# Altium schematic sheet Fornello.SchDoc
size A2
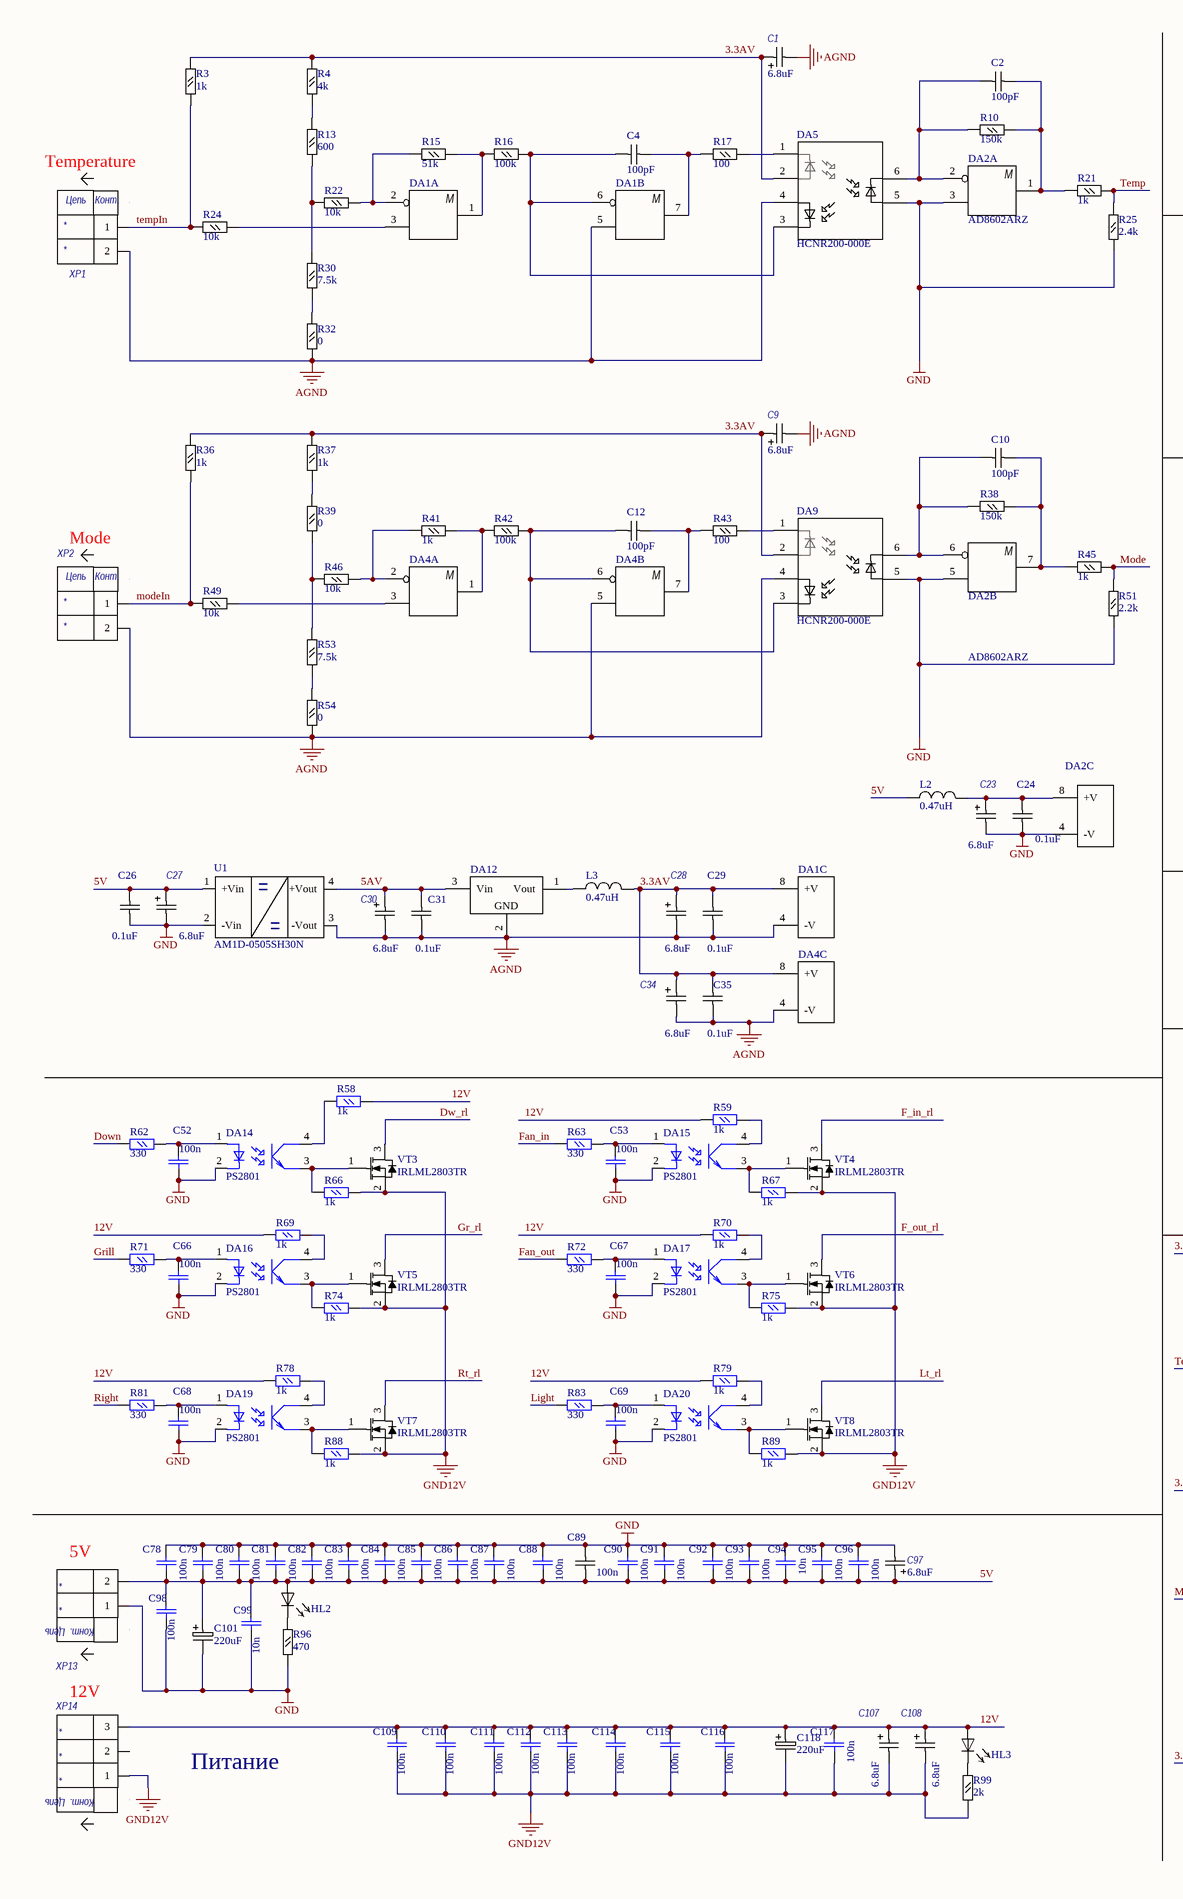
[diagram p0: Fornello.SchDoc, left]
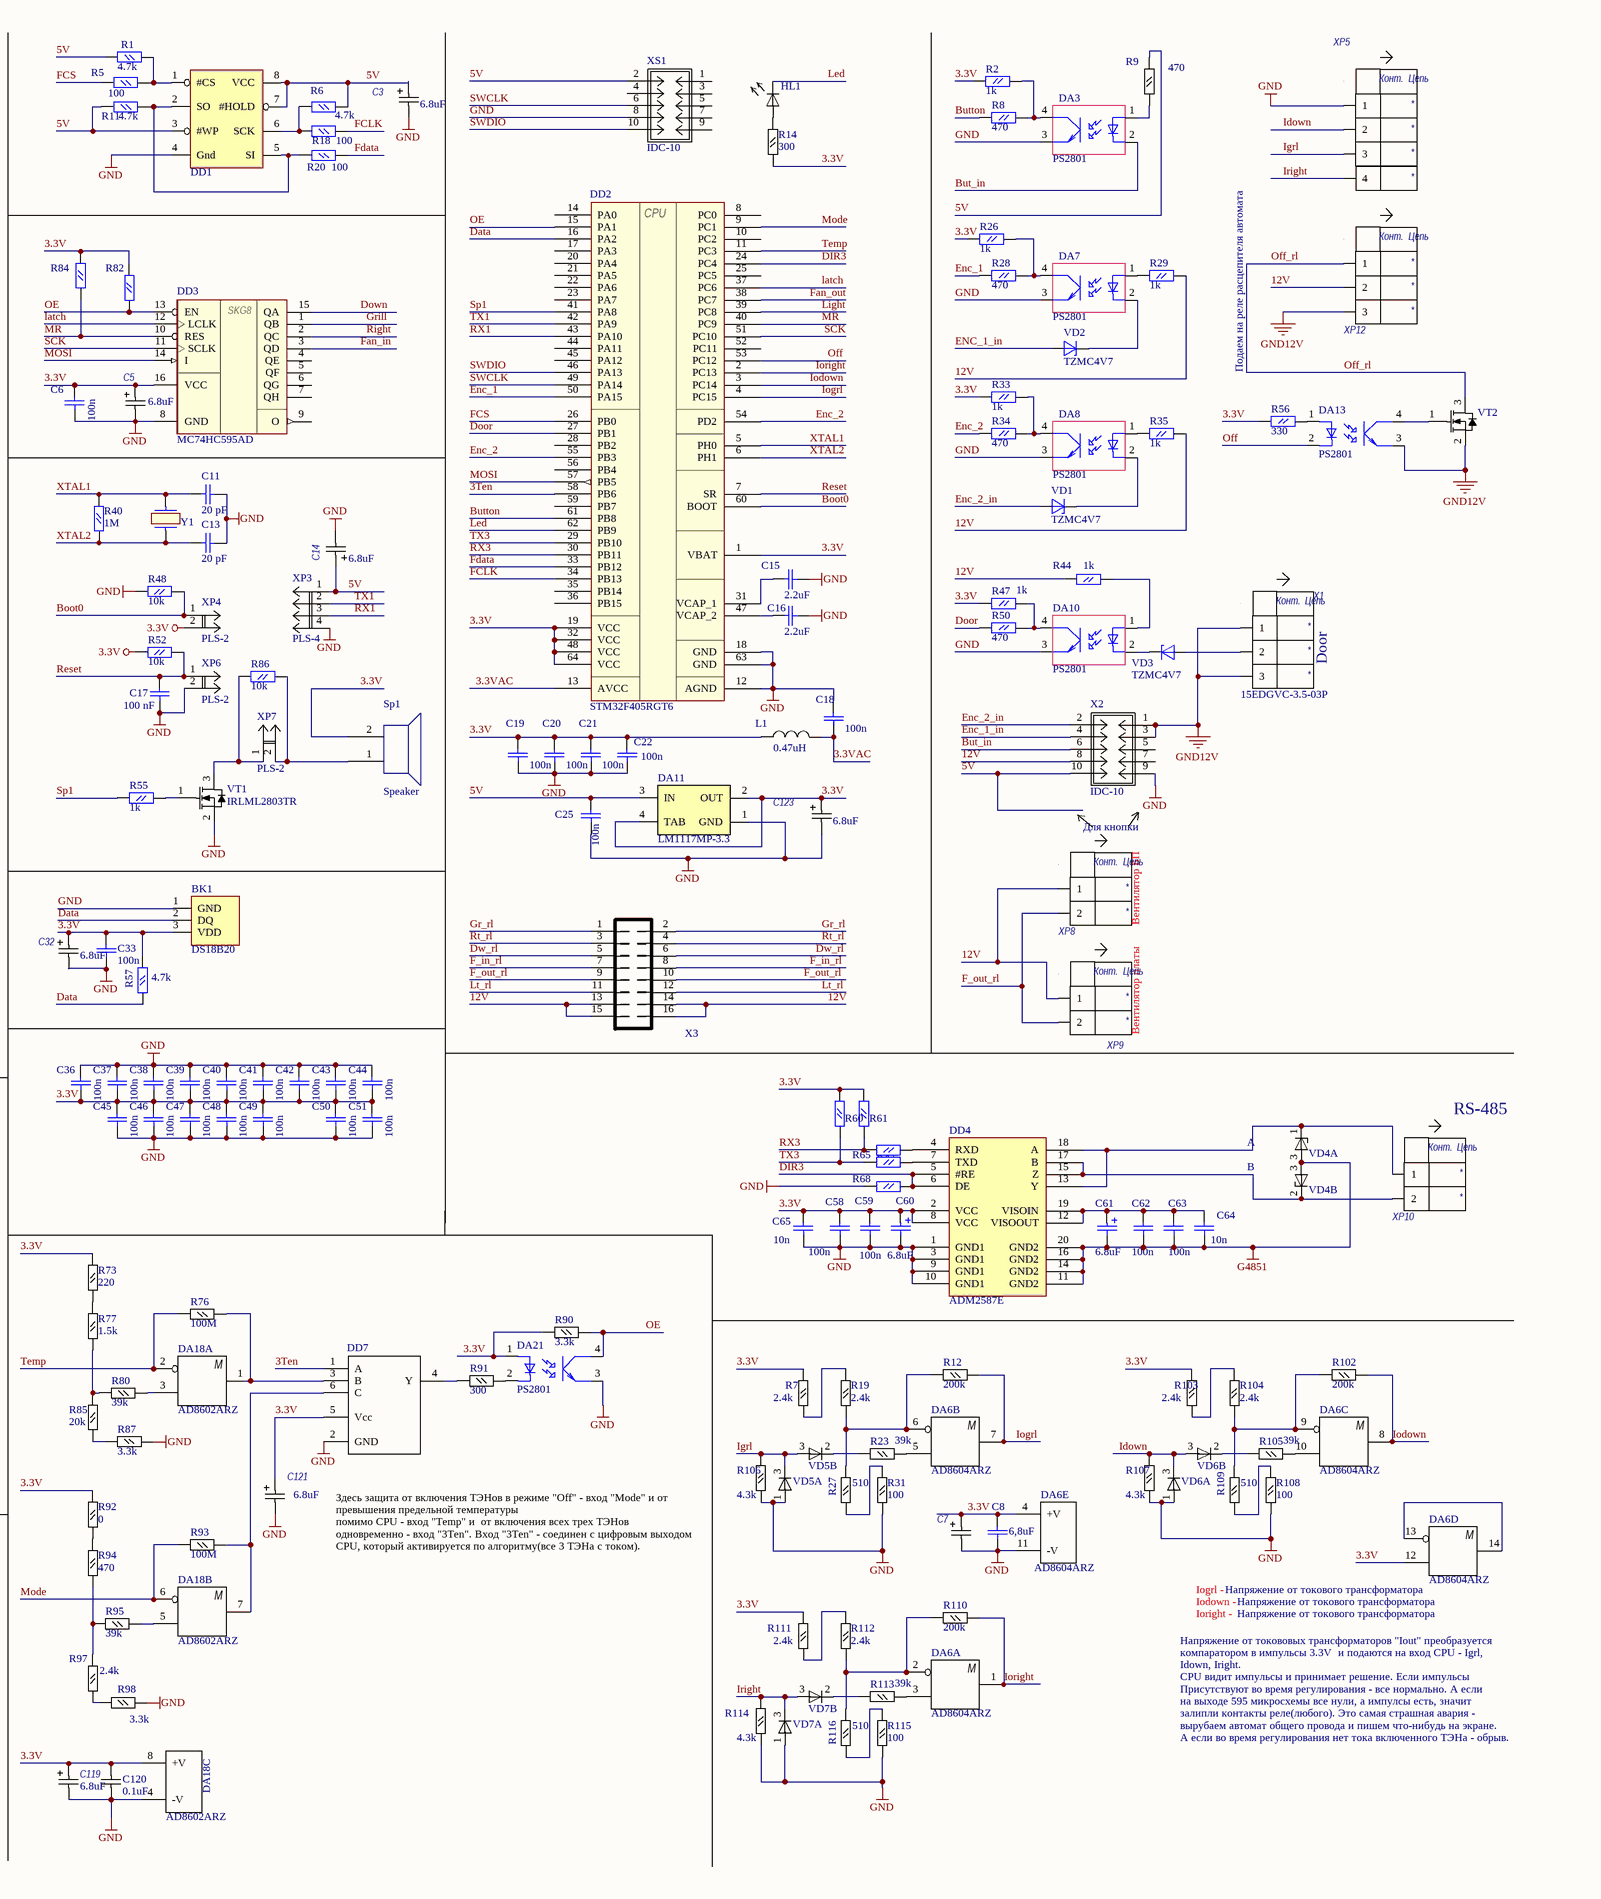
[diagram p1: Fornello.SchDoc, right]

## Parts
BK1  DS18B20  [TO-92]
C1  6.8uF  [TC3216-1206-A]
C2  100pF  [cap0805]
C3  6.8uF  [TC3216-1206-A]
C4  100pF  [cap0805]
C5  6.8uF  [TC3216-1206-A]
C6  100n  [cap0805]
C7  6,8uF  [TC3216-1206-A]
C8  0.1uF  [cap0805]  (value not drawn)
C9  6.8uF  [TC3216-1206-A]
C10  100pF  [cap0805]
C11  20 pF  [cap0805]
C12  100pF  [cap0805]
C13  20 pF  [cap0805]
C14  6.8uF  [TC3216-1206-A]
C15  2.2uF  [cap0805]
C16  2.2uF  [cap0805]
C17  100 nF  [cap0805]
C18  100n  [cap0805]
C19  100n  [cap0805]
C20  100n  [cap0805]
C21  100n  [cap0805]
C22  100n  [cap0805]
C23  6.8uF  [TC3216-1206-A]
C24  0.1uF  [cap0805]
C25  100n  [cap0805]
C26  0.1uF  [cap0805]
C27  6.8uF  [TC3216-1206-A]
C28  6.8uF  [TC3216-1206-A]
C29  0.1uF  [cap0805]
C30  6.8uF  [TC3216-1206-A]
C31  0.1uF  [cap0805]
C32  6.8uF  [TC3216-1206-A]
C33  100n  [cap0805]
C34  6.8uF  [TC3216-1206-A]
C35  0.1uF  [cap0805]
C36  100n  [cap0805]
C37  100n  [cap0805]
C38  100n  [cap0805]
C39  100n  [cap0805]
C40  100n  [cap0805]
C41  100n  [cap0805]
C42  100n  [cap0805]
C43  100n  [cap0805]
C44  100n  [cap0805]
C45  100n  [cap0805]
C46  100n  [cap0805]
C47  100n  [cap0805]
C48  100n  [cap0805]
C49  100n  [cap0805]
C50  100n  [cap0805]
C51  100n  [cap0805]
C52  100n  [cap0805]
C53  100n  [cap0805]
C58  100n  [cap0805]
C59  100n  [cap0805]
C60  6.8uF  [TC3216-1206-A]
C61  6.8uF  [TC3216-1206-A]
C62  100n  [cap0805]
C63  100n  [cap0805]
C64  10n  [cap0805]
C65  10n  [cap0805]
C66  100n  [cap0805]
C67  100n  [cap0805]
C68  100n  [cap0805]
C69  100n  [cap0805]
C78  100n  [cap0805]
C79  100n  [cap0805]
C80  100n  [cap0805]
C81  100n  [cap0805]
C82  100n  [cap0805]
C83  100n  [cap0805]
C84  100n  [cap0805]
C85  100n  [cap0805]
C86  100n  [cap0805]
C87  100n  [cap0805]
C88  100n  [cap0805]
C89  100n  [cap0805]
C90  100n  [cap0805]
C91  100n  [cap0805]
C92  100n  [cap0805]
C93  100n  [cap0805]
C94  10n  [cap0805]
C95  100n  [cap0805]
C96  100n  [cap0805]
C97  6.8uF  [TC3216-1206-A]
C98  100n  [cap0805]
C99  10n  [cap0805]
C101  220uF  [6.3D]
C107  6.8uF  [TC3216-1206-A]
C108  6.8uF  [TC3216-1206-A]
C109  100n  [cap0805]
C110  100n  [cap0805]
C111  100n  [cap0805]
C112  100n  [cap0805]
C113  100n  [cap0805]
C114  100n  [cap0805]
C115  100n  [cap0805]
C116  100n  [cap0805]
C117  100n  [cap0805]
C118  220uF  [6.3D]
C119  6.8uF  [TC3216-1206-A]
C120  0.1uF  [cap0805]
C121  6.8uF  [TC3216-1206-A]
C123  6.8uF  [TC3216-1206-A]
DA1  AD8602ARZ  [SO-8]  (value not drawn)  (parts A,B,C of 3)
DA2  AD8602ARZ  [SO-8]  (parts A,B,C of 3)
DA3  PS2801  [SOP4]
DA4  AD8602ARZ  [SO-8]  (value not drawn)  (parts A,B,C of 3)
DA5  HCNR200-000E  [DIP8]
DA6  AD8604ARZ  [SO-14]  (parts A,B,C,D,E of 5)
DA7  PS2801  [SOP4]
DA8  PS2801  [SOP4]
DA9  HCNR200-000E  [DIP8]
DA10  PS2801  [SOP4]
DA11  LM1117MP-3.3  [SOT223]
DA12  L78L33ACUTR  [SOT89]  (value not drawn)
DA13  PS2801  [SOP4]
DA14  PS2801  [SOP4]
DA15  PS2801  [SOP4]
DA16  PS2801  [SOP4]
DA17  PS2801  [SOP4]
DA18  AD8602ARZ  [SO-8]  (parts A,B,C of 3)
DA19  PS2801  [SOP4]
DA20  PS2801  [SOP4]
DA21  PS2801  [SOP4]
DD1  (no value)  [SO-8_N]
DD2  STM32F405RGT6  [LQFP64]
DD3  MC74HC595AD  [SO-16]
DD4  ADM2587E  [SO-20_N]
DD7  SN74LVC1G97  [SOT23-6]  (value not drawn)
HL1  KP-2012SGC  [Led0805]  (value not drawn)
HL2  KP-2012SRC  [Led0805]  (value not drawn)
HL3  KP-2012SRC  [Led0805]  (value not drawn)
L1  0.47uH  [res0805]
L2  0.47uH  [0805]
L3  0.47uH  [0805]
R1  4.7k  [res0805]
R2  1k  [res0805]
R3  1k  [res0805]
R4  4k  [res0805]
R5  100  [res0805]
R6  4.7k  [res0805]
R7  2.4k  [res0805]
R8  470  [res0805]
R9  470  [res0805]
R10  150k  [res0805]
R11  4.7k  [res0805]
R12  200k  [res0805]
R13  600  [res0805]
R14  300  [res0805]
R15  51k  [res0805]
R16  100k  [res0805]
R17  100  [res0805]
R18  100  [res0805]
R19  2.4k  [res0805]
R20  100  [res0805]
R21  1k  [res0805]
R22  10k  [res0805]
R23  39k  [res0805]
R24  10k  [res0805]
R25  2.4k  [res0805]
R26  1k  [res0805]
R27  510  [res0805]
R28  470  [res0805]
R29  1k  [res0805]
R30  7.5k  [res0805]
R31  100  [res0805]
R32  0  [res0805]
R33  1k  [res0805]
R34  470  [res0805]
R35  1k  [res0805]
R36  1k  [res0805]
R37  1k  [res0805]
R38  150k  [res0805]
R39  0  [res0805]
R40  1M  [res0805]
R41  1k  [res0805]
R42  100k  [res0805]
R43  100  [res0805]
R44  1k  [res0805]
R45  1k  [res0805]
R46  10k  [res0805]
R47  1k  [res0805]
R48  10k  [res0805]
R49  10k  [res0805]
R50  470  [res0805]
R51  2.2k  [res0805]
R52  10k  [res0805]
R53  7.5k  [res0805]
R54  0  [res0805]
R55  1k  [res0805]
R56  330  [res0805]
R57  4.7k  [res0805]
R58  1k  [res0805]
R59  1k  [res0805]
R60  4.7k  [res0805]  (value not drawn)
R61  4.7k  [res0805]  (value not drawn)
R62  330  [res0805]
R63  330  [res0805]
R64  100  [res0805]  (value not drawn)
R65  100  [res0805]  (value not drawn)
R66  1k  [res0805]
R67  1k  [res0805]
R68  4.7k  [res0805]  (value not drawn)
R69  1k  [res0805]
R70  1k  [res0805]
R71  330  [res0805]
R72  330  [res0805]
R73  220  [res0805]
R74  1k  [res0805]
R75  1k  [res0805]
R76  100M  [res0805]
R77  1.5k  [res0805]
R78  1k  [res0805]
R79  1k  [res0805]
R80  39k  [res0805]
R81  330  [res0805]
R82  4.7k  [res0805]  (value not drawn)
R83  330  [res0805]
R84  4.7k  [res0805]  (value not drawn)
R85  20k  [res0805]
R86  10k  [res0805]
R87  3.3k  [res0805]
R88  1k  [res0805]
R89  1k  [res0805]
R90  3.3k  [res0805]
R91  300  [res0805]
R92  0  [res0805]
R93  100M  [res0805]
R94  470  [res0805]
R95  39k  [res0805]
R96  470  [res0805]
R97  2.4k  [res0805]
R98  3.3k  [res0805]
R99  2k  [res0805]
R102  200k  [res0805]
R103  2.4k  [res0805]
R104  2.4k  [res0805]
R105  39k  [res0805]
R106  4.3k  [res0805]
R107  4.3k  [res0805]
R108  100  [res0805]
R109  510  [res0805]
R110  200k  [res0805]
R111  2.4k  [res0805]
R112  2.4k  [res0805]
R113  39k  [res0805]
R114  4.3k  [res0805]
R115  100  [res0805]
R116  510  [res0805]
Sp1  Speaker  [Speaker]
U1  AM1D-0505SH30N  [SIP7S]
VD1  TZMC4V7  [SOD80]
VD2  TZMC4V7  [SOD80]
VD3  TZMC4V7  [SOD80]
VD4  SM712-02HTG  [SOT23]  (value not drawn)  (parts A,B of 2)
VD5  BAV99  [SOT23]  (value not drawn)  (parts A,B of 2)
VD6  BAV99  [SOT23]  (value not drawn)  (parts A,B of 2)
VD7  BAV99  [SOT23]  (value not drawn)  (parts A,B of 2)
VT1  IRLML2803TR  [SOT23]
VT2  IRLML2803TR  [SOT23]  (value not drawn)
VT3  IRLML2803TR  [SOT23]
VT4  IRLML2803TR  [SOT23]
VT5  IRLML2803TR  [SOT23]
VT6  IRLML2803TR  [SOT23]
VT7  IRLML2803TR  [SOT23]
VT8  IRLML2803TR  [SOT23]
X1  15EDGVC-3.5-03P  [15EDGVC-3.5-03P-2]
X2  IDC-10  [IDC-10]
X3  PBD-16  [Pl_connect]  (value not drawn)
XP1  15EDGVC-3.5-02P  [15EDGVC-3.5-02P]  (value not drawn)
XP2  15EDGVC-3.5-02P  [15EDGVC-3.5-02P]  (value not drawn)
XP3  PLS-4  [PLS4]
XP4  PLS-2  [PLS2]
XP5  15EDGVC-3.5-04P  [15EDGVC-3.5-04P]  (value not drawn)
XP6  PLS-2  [PLS2]
XP7  PLS-2  [PLS2]
XP8  15EDGVC-3.5-02P  [15EDGVC-3.5-02P]  (value not drawn)
XP9  15EDGVC-3.5-02P  [15EDGVC-3.5-02P]  (value not drawn)
XP10  15EDGVC-3.5-02P  [15EDGVC-3.5-02P]  (value not drawn)
XP12  15EDGVC-3.5-03P  [15EDGVC-3.5-03P-2]  (value not drawn)
XP13  15EDGVC-3.5-02P  [15EDGVC-3.5-02P]  (value not drawn)
XP14  15EDGVC-3.5-03P  [15EDGVC-3.5-03P-2]  (value not drawn)
XS1  IDC-10  [IDC-10]
Y1  8MHz  [XT49M]  (value not drawn)

## Nets
3.3V: BK1.3(VDD) C5.1 C6.1 C7.1 C8.1 C19.1 C20.1 C21.1 C22.1 C32.1 C33.1 C36.2 C37.2 C38.2 C39.2 C40.2 C41.2 C42.2 C43.2 C44.2 C45.1 C46.1 C47.1 C48.1 C49.1 C50.1 C51.1 C58.1 C59.1 C60.1 C65.1 C119.1 C120.1 C121.1 C123.1 DA6.4(+V) DA6.12(IN+) DA11.2(OUT) DA11.4(TAB) DA18.8(+V) DA21.1(A) DD2.1(VBAT) DD2.19(VCC) DD2.32(VCC) DD2.48(VCC) DD2.64(VCC) DD3.16(VCC) DD4.2(VCC) DD4.8(VCC) DD7.5(Vcc) L1.1 R2.2 R7.2 R14.1 R26.2 R33.2 R47.2 R52.1 R56.2 R57.2 R60.2 R61.2 R73.2 R82.2 R84.2 R90.2 R92.2 R103.2 R111.2 Sp1.2 XP4.2
AGND: C1.2 C9.2 C28.2 C29.1 C30.2 C31.1 C34.2 C35.1 DA1.4(-V) DA1.5(IN+) DA4.4(-V) DA4.5(IN+) DA5.4(PD1_A) DA9.4(PD1_A) DA12.0(GND) DA12.2(GND) R32.1 R54.1 U1.3(-Vout) XP1.2 XP2.2
G4851: C61.2 C62.2 C63.2 C64.2 DD4.11(GND2) DD4.14(GND2) DD4.16(GND2) DD4.20(GND2) VD4.3(A)
GND: BK1.1(GND) C3.2 C5.2 C6.2 C7.2 C8.2 C11.2 C13.2 C14.2 C15.2 C16.2 C17.2 C18.1 C19.2 C20.2 C21.2 C22.2 C23.2 C24.1 C25.2 C26.1 C27.2 C32.2 C33.2 C36.1 C37.1 C38.1 C39.1 C40.1 C41.1 C42.1 C43.1 C44.1 C45.2 C46.2 C47.2 C48.2 C49.2 C50.2 C51.2 C52.2 C53.2 C58.2 C59.2 C60.2 C65.2 C66.2 C67.2 C68.2 C69.2 C78.1 C79.1 C80.1 C81.1 C82.1 C83.1 C84.1 C85.1 C86.1 C87.1 C88.1 C89.1 C90.1 C91.1 C92.1 C93.1 C94.1 C95.1 C96.1 C97.2 C98.2 C99.2 C101.2 C119.2 C120.2 C121.2 C123.2 DA2.3(IN+) DA2.4(-V) DA2.5(IN+) DA3.3(E) DA5.5(PD2_A) DA6.11(-V) DA7.3(E) DA8.3(E) DA9.5(PD2_A) DA10.3(E) DA11.1(GND) DA14.2(K) DA15.2(K) DA16.2(K) DA17.2(K) DA18.4(-V) DA19.2(K) DA20.2(K) DA21.3(E) DD1.4(Gnd) DD2.12(AGND) DD2.18(GND) DD2.63(GND) DD3.8(GND) DD4.1(GND1) DD4.3(GND1) DD4.9(GND1) DD4.10(GND1) DD7.2(GND) R25.1 R31.1 R48.1 R51.1 R68.2 R87.1 R96.2 R98.1 R106.1 R107.1 R108.1 R114.1 R115.1 U1.2(-Vin) VD5.1(A1) VD6.1(A1) VD7.1(A1) VT1.2(D) X2.9 XP3.4 XP5.1 XP6.2 XP13.1 XS1.8
GND12V: C107.2 C108.2 C109.2 C110.2 C111.2 C112.2 C113.2 C114.2 C115.2 C116.2 C117.2 C118.2 DA13.3(E) R66.1 R67.1 R74.1 R75.1 R88.1 R89.1 R99.2 VT2.2(D) VT3.2(D) VT4.2(D) VT5.2(D) VT6.2(D) VT7.2(D) VT8.2(D) X1.1 X1.3 X2.1 X2.3 XP12.3 XP14.1
3.3AV: C1.1 C9.1 C28.1 C29.2 C34.1 C35.2 DA1.8(+V) DA4.8(+V) DA5.2(LED_A) DA9.2(LED_A) L3.2 R3.2 R4.2 R36.2 R37.2
3.3VAC: C18.2 DD2.13(AVCC) L1.2
3Ten: DD2.58(PB6) DD7.1(A)
5AV: C30.1 C31.2 DA12.3(Vin) U1.4(+Vout)
5V: C3.1 C14.1 C25.1 C26.2 C27.1 C78.2 C79.2 C80.2 C81.2 C82.2 C83.2 C84.2 C85.2 C86.2 C87.2 C88.2 C89.2 C90.2 C91.2 C92.2 C93.2 C94.2 C95.2 C96.2 C97.1 C98.1 C99.1 C101.1 DA11.3(IN) DD1.3(#WP) DD1.7(#HOLD) DD1.8(VCC) HL2.1(A) L2.1 R1.1 R6.2 R9.2 R11.1 U1.1(+Vin) X2.10 XP3.1 XP13.2 XS1.2
12V: C107.1 C108.1 C109.1 C110.1 C111.1 C112.1 C113.1 C114.1 C115.1 C116.1 C117.1 C118.1 HL3.1(A) R29.2 R35.2 R44.1 R58.2 R59.2 R69.2 R70.2 R78.2 R79.2 X2.8 X3.13 X3.14 X3.15 X3.16 XP8.1 XP9.1 XP12.2 XP14.3
Boot0: DD2.60(BOOT) R48.2 XP4.1
But_in: DA3.2(K) X2.6
Button: DD2.61(PB8) R8.2
Data: BK1.2(DQ) DD2.16(PA2) R57.1
DIR3: DD2.24(PC4) DD4.5(#RE) DD4.6(DE) R68.1
Door: DD2.27(PB1) R50.2
Down: DD3.15(QA) R62.1
Dw_rl: VT3.3(S) X3.5 X3.6
Enc_1: DD2.50(PA15) R28.2
ENC_1_in: VD2.1(A) X2.4
Enc_2: DD2.54(PD2) DD2.55(PB3) R34.2
Enc_2_in: VD1.1(A) X2.2
F_in_rl: VT4.3(S) X3.7 X3.8
F_out_rl: VT6.3(S) X3.9 X3.10 XP8.2 XP9.2
Fan_in: DD3.3(QD) R63.1
Fan_out: DD2.38(PC7) R72.1
FCLK: DD2.34(PB13) R18.2
FCS: DD2.26(PB0) R5.1
Fdata: DD2.33(PB12) R20.2
Gr_rl: VT5.3(S) X3.1 X3.2
Grill: DD3.1(QB) R71.1
Idown: R107.2 VD6.3(COM) XP5.2
Igrl: R106.2 VD5.3(COM) XP5.3
Iodown: DA6.8(OUT) DD2.3(PC14) R102.2
Iogrl: DA6.7(OUT) DD2.4(PC15) R12.2
Ioright: DA6.1(OUT) DD2.2(PC13) R110.2
Iright: R114.2 VD7.3(COM) XP5.4
latch: DD2.37(PC6) DD3.12(LCLK)
Led: DD2.62(PB9) HL1.2(K)
Light: DD2.39(PC8) R83.1
Lt_rl: VT8.3(S) X3.11 X3.12
Mode: DA18.6(IN-) DD2.9(PC1) R45.2 R51.2 R93.1
modeIn: R36.1 R49.1 XP2.1
MOSI: DD2.57(PB5) DD3.14(I)
MR: DD2.40(PC9) DD3.10(RES) R84.1
OE: DA21.4(C) DD2.15(PA1) DD3.13(EN) R82.1 R90.1
Off: DA13.2(K) DD2.53(PC12)
Off_rl: VT2.3(S) XP12.1
Reset: C17.1 DD2.7(SR) R52.2 XP6.1
Right: DD3.2(QC) R81.1
Rt_rl: VT7.3(S) X3.3 X3.4
RX1: DD2.43(PA10) XP3.3
RX3: DD2.30(PB11) R61.1 R64.2
SCK: DD2.51(PC10) DD3.11(SCLK)
Sp1: DD2.41(PA8) R55.1
SWCLK: DD2.49(PA14) XS1.6
SWDIO: DD2.46(PA13) XS1.10
Temp: DA18.2(IN-) DD2.11(PC3) R21.2 R25.2 R76.1
tempIn: R3.1 R24.1 XP1.1
TX1: DD2.42(PA9) XP3.2
TX3: DD2.29(PB10) R60.1 R65.2
XTAL1: C11.1 DD2.5(PH0) R40.2 Y1.2(L2)
XTAL2: C13.1 DD2.6(PH1) R40.1 Y1.1(L1)
NetC2_1: C2.1 DA2.2(IN-) DA5.6(PD2_C) R10.1
NetC2_2: C2.2 DA2.1(OUT) R10.2 R21.1
NetC4_1: C4.1 DA1.6(IN-) DA5.3(PD1_C) R16.2
NetC4_2: C4.2 DA1.7(OUT) R17.1
NetC10_1: C10.1 DA2.6(IN-) DA9.6(PD2_C) R38.1
NetC10_2: C10.2 DA2.7(OUT) R38.2 R45.1
NetC12_1: C12.1 DA4.6(IN-) DA9.3(PD1_C) R42.2
NetC12_2: C12.2 DA4.7(OUT) R43.1
NetC15_1: C15.1 DD2.31(VCAP_1)
NetC16_1: C16.1 DD2.47(VCAP_2)
NetC23_1: C23.1 C24.2 DA2.8(+V) L2.2
NetC52_1: C52.1 DA14.1(A) R62.2
NetC53_1: C53.1 DA15.1(A) R63.2
NetC61_1: C61.1 C62.1 C63.1 C64.1 DD4.12(VISOOUT) DD4.19(VISOIN)
NetC66_1: C66.1 DA16.1(A) R71.2
NetC67_1: C67.1 DA17.1(A) R72.2
NetC68_1: C68.1 DA19.1(A) R81.2
NetC69_1: C69.1 DA20.1(A) R83.2
NetDA1_1: DA1.1(OUT) R15.2 R16.1
NetDA1_2: DA1.2(IN-) R15.1 R22.2
NetDA1_3: DA1.3(IN+) R24.2
NetDA3_1: DA3.1(A) R9.1
NetDA3_4: DA3.4(C) R2.1 R8.1
NetDA4_1: DA4.1(OUT) R41.2 R42.1
NetDA4_2: DA4.2(IN-) R41.1 R46.2
NetDA4_3: DA4.3(IN+) R49.2
NetDA5_1: DA5.1(LED_C) R17.2
NetDA6_2: DA6.2(IN-) R110.1 R112.1 R116.2
NetDA6_3: DA6.3(IN+) R113.2
NetDA6_5: DA6.5(IN+) R23.2
NetDA6_6: DA6.6(IN-) R12.1 R19.1 R27.2
NetDA6_9: DA6.9(IN-) R102.1 R104.1 R109.2
NetDA6_10: DA6.10(IN+) R105.2
NetDA6_13: DA6.13(IN-) DA6.14(OUT)
NetDA7_1: DA7.1(A) R29.1
NetDA7_2: DA7.2(K) VD2.2(K)
NetDA7_4: DA7.4(C) R26.1 R28.1
NetDA8_1: DA8.1(A) R35.1
NetDA8_2: DA8.2(K) VD1.2(K)
NetDA8_4: DA8.4(C) R33.1 R34.1
NetDA9_1: DA9.1(LED_C) R43.2
NetDA10_1: DA10.1(A) R44.2
NetDA10_2: DA10.2(K) VD3.2(K)
NetDA10_4: DA10.4(C) R47.1 R50.1
NetDA12_1: DA12.1(Vout) L3.1
NetDA13_1: DA13.1(A) R56.1
NetDA13_4: DA13.4(C) VT2.1(G)
NetDA14_3: DA14.3(E) R66.2 VT3.1(G)
NetDA14_4: DA14.4(C) R58.1
NetDA15_3: DA15.3(E) R67.2 VT4.1(G)
NetDA15_4: DA15.4(C) R59.1
NetDA16_3: DA16.3(E) R74.2 VT5.1(G)
NetDA16_4: DA16.4(C) R69.1
NetDA17_3: DA17.3(E) R75.2 VT6.1(G)
NetDA17_4: DA17.4(C) R70.1
NetDA18_1: DA18.1(OUT) DD7.3(B) R76.2
NetDA18_3: DA18.3(IN+) R80.2
NetDA18_5: DA18.5(IN+) R95.2
NetDA18_7: DA18.7(OUT) DD7.6(C) R93.2
NetDA19_3: DA19.3(E) R88.2 VT7.1(G)
NetDA19_4: DA19.4(C) R78.1
NetDA20_3: DA20.3(E) R89.2 VT8.1(G)
NetDA20_4: DA20.4(C) R79.1
NetDA21_2: DA21.2(K) R91.1
NetDD1_1: DD1.1(#CS) R1.2 R5.2
NetDD1_2: DD1.2(SO) DD1.5(SI) R11.2 R20.1
NetDD1_6: DD1.6(SCK) R6.1 R18.1
NetDD4_4: DD4.4(RXD) R64.1
NetDD4_7: DD4.7(TXD) R65.1
NetDD4_13: DD4.13(Y) DD4.18(A) VD4.1(K1) XP10.1
NetDD4_15: DD4.15(Z) DD4.17(B) VD4.2(K2) XP10.2
NetDD7_4: DD7.4(Y) R91.2
NetHL1_1: HL1.1(A) R14.2
NetHL2_2: HL2.2(K) R96.1
NetHL3_2: HL3.2(K) R99.1
NetR4_1: R4.1 R13.2
NetR7_1: R7.1 R19.2
NetR13_1: R13.1 R22.1 R30.2
NetR23_1: R23.1 VD5.2(K2)
NetR27_1: R27.1 R31.2
NetR30_1: R30.1 R32.2
NetR37_1: R37.1 R39.2
NetR39_1: R39.1 R46.1 R53.2
NetR53_1: R53.1 R54.2
NetR55_2: R55.2 VT1.1(G)
NetR73_1: R73.1 R77.2
NetR77_1: R77.1 R80.1 R85.2
NetR85_1: R85.1 R87.2
NetR86_1: R86.1 VT1.3(S) XP7.1
NetR86_2: R86.2 Sp1.1 XP7.2
NetR92_1: R92.1 R94.2
NetR94_1: R94.1 R95.1 R97.2
NetR97_1: R97.1 R98.2
NetR103_1: R103.1 R104.2
NetR105_1: R105.1 VD6.2(K2)
NetR108_2: R108.2 R109.1
NetR111_1: R111.1 R112.2
NetR113_1: R113.1 VD7.2(K2)
NetR115_2: R115.2 R116.1
NetVD3_1: VD3.1(A) X1.2

Not connected (* = marked no-connect by the designer): DD2 8(PC0) 10(PC2) 14(PA0) 17(PA3) 20(PA4) 21(PA5) 22(PA6) 23(PA7) 25(PC5) 28(PB2) 35(PB14) 36(PB15) 44(PA11) 45(PA12) 52(PC11) 56(PB4) 59(PB7); DD3 4(QE) 5(QF) 6(QG) 7(QH) 9(O); X2 5 7; XP14 2; XS1 1 3 4 5 7 9

## Notes on the sheet
- Temperature
- Подаем на реле расцепителя автомата
- Mode
- Door
- Для кнопки
- Вентилятор БП
- Вентилятор платы
- RS-485
- A
- B
- (near XP13) 5V
- Здесь защита от включения ТЭНов в режиме "Off" - вход "Mode" и от превышения предельной температуры
  помимо CPU - вход "Temp" и  от включения всех трех ТЭНов одновременно - вход "3Ten". Вход "3Ten" - соединен с цифровым выходом CPU, который активируется по алгоритму(все 3 ТЭНа с током).
- Iogrl -
- Iodown -
- Ioright -
- (near DA6) Напряжение от токового трансформатора
- Напряжение от токововых трансформаторов "Iout" преобразуется
- компаратором в импульсы 3.3V
- CPU видит импульсы и принимает решение. Если импульсы
- Idown, Iright.
- и подаются на вход CPU - Igrl,
- (near XP14) 12V
- Присутствуют во время регулирования - все нормально. А если
- на выходе 595 микросхемы все нули, а импулсы есть, значит
- залипли контакты реле(любого). Это самая страшная авария -
- вырубаем автомат общего провода и пишем что-нибудь на экране.
- А если во время регулирования нет тока включенного ТЭНа - обрыв.
- Питание
- (in symbol 15EDGVC-3.5-02P) Конт.; Цепь
- (in symbol 15EDGVC-3.5-03P) Цепь; Конт.
- (in symbol 15EDGVC-3.5-04P) Конт.; Цепь
- (in symbol AD8602ARZ, part A) M
- (in symbol AD8602ARZ, part B) M
- (in symbol AD8604ARZ, part A) M
- (in symbol AD8604ARZ, part B) M
- (in symbol AD8604ARZ, part C) M
- (in symbol AD8604ARZ, part D) M
- (in symbol MC74HC595AD) SKG8
- (in symbol STM32F405RGT6) CPU

## Library data of the parts
BK1 = DS18B20: Датчик Далласа; Group: Микросхемы; SType: TH; NPads: 3; Part Number: DS18B20; ValueSCH: DS18B20; Package: TO-92; HelpURL: \DATA\DS18B20.pdf
C1 C3 C5 C7 C9 C14 C23 C27 C28 C30 C32 C34 C60 C61 C97 C107 C108 C119 C121 C123 = capA: Танталовый конденсатор, SMD; Part Number: capA; Group: Конденсаторы; NPads: 2; SType: SMD; Package: SMD A
  C1 C3 C5 C9 C14 C23 C27 C28 C30 C32 C34 C60 C61 C97 C107 C108 C119 C121 C123: ValueSCH: 6.8uF
  C7: ValueSCH: 6,8uF
C2 C4 C6 C8 C10-C13 C15-C22 C24-C26 C29 C31 C33 C35-C53 C58 C59 C62-C69 C78-C96 C98 C99 C109-C117 C120 = cap0805: Керамический конденсатор, SMD; Group: Конденсаторы; NPads: 2; Part Number: cap0805; SType: SMD; Package: SMD 0805
  C2 C4 C10 C12: ValueSCH: 100pF
  C6 C18-C22 C25 C33 C36-C53 C58 C59 C62 C63 C66-C69 C78-C93 C95 C96 C98 C109-C117: ValueSCH: 100n
  C8 C24 C26 C29 C31 C35 C120: ValueSCH: 0.1uF
  C11 C13: ValueSCH: 20 pF
  C15 C16: ValueSCH: 2.2uF
  C17: ValueSCH: 100 nF
  C64 C65 C94 C99: ValueSCH: 10n
C101 C118 = UCD1V101MCL6GS: Алюминиевый конденсатор 6.3mm; Group: Конденсаторы; SType: SMD; NPads: 2; Part Number: UCD1V101MCL6GS; ValueSCH: 220uF; Package: Can - SMD
DA1 DA2 DA4 DA18 = AD8602ARZ: Операционный усилитель 2 в 1; Group: Микросхемы; SType: SMD; NPads: 8; Part Number: AD8602ARZ; ValueSCH: AD8602ARZ; Package: SO-8
DA3 DA7 DA8 DA10 DA13-DA17 DA19-DA21 = PS2801: Оптопара; Group: Микросхемы; SType: SMD; NPads: 4; Part Number: PS2801; ValueSCH: PS2801; Package: SOP4; HelpURL: \DATA\PS2801.pdf
DA5 DA9 = HCNR200-000E: Аналоговый оптрон прецизионный; Group: Микросхемы; SType: TH; NPads: 8; Part Number: HCNR200-000E; ValueSCH: HCNR200-000E; Package: SOP-8
DA6 = AD8604ARZ: Операционный усилитель 4 в 1; Group: Микросхемы; SType: SMD; NPads: 14; Part Number: AD8604ARZ; ValueSCH: AD8604ARZ; Package: SO-14
DA11 = LM1117MP-3.3: Линейный стабилизатор 3.3V; Group: Микросхемы; SType: SMD; Analog: SPX1117M3L-3.3; NPads: 4; Part Number: LM1117MP-3.3; ValueSCH: LM1117MP-3.3; Package: SOT223; HelpURL: \DATA\LM1117.pdf
DA12 = L78L33ACUTR: Линейный стабилизатор 3.3V; Group: Микросхемы; SType: SMD; NPads: 4; Part Number: L78L33ACUTR; ValueSCH: L78L33ACUTR; Package: SOT89
DD1 = FM25040S
DD2 = STM32F405RGT6: Микроконтроллер 32 бит CORTEX M4; Group: Микросхемы; SType: SMD; NPads: 64; Part Number: STM32F405RGT6; ValueSCH: STM32F405RGT6; Package: LQFP64
DD3 = MC74HC595AD: 3-х разрядный сдвиговый регистр; Group: Микросхемы; SType: SMD; NPads: 16; Part Number: MC74HC595AD; ValueSCH: MC74HC595AD; Package: SO-16
DD4 = ADM2587E: Трансивер RS-485 / RS-422; Group: Микросхемы; SType: SMD; NPads: 20; Part Number: ADM2587E; ValueSCH: ADM2587E; Package: SO-20; HelpURL: \DATA\ADM2587E.pdf
DD7 = SN74LVC1G11DBVR: Блок одиночный 3И; Group: Микросхемы; SType: SMD; NPads: 6; Part Number: SN74LVC1G11DBVR; ValueSCH: SN74LVC1G97; Package: SOT23-6
HL1 = KP-2012SGC: SMD светодиод зеленый; Group: Диоды; NPads: 2; Part Number: KP-2012SGC; ValueSCH: KP-2012SGC; SType: SMD; Package: SMD 0805
HL2 HL3 = KP-2012SRC: SMD светодиод красный; Group: Диоды; NPads: 2; Part Number: KP-2012SRC; ValueSCH: KP-2012SRC; SType: SMD; Package: SMD 0805
L1 = L0805: Чип-индуктивность, SMD; Part Number: L0805; Group: Индукивности; NPads: 2; SType: SMD; ValueSCH: 0.47uH; Package: SMD 0805
L2 L3 = L0805: Чип-индуктивность, SMD; Part Number: L0805; Group: Индуктивности; NPads: 2; ValueSCH: 0.47uH; SType: SMD; Package: SMD 0805
R1-R99 R102-R116 = res0805: Резистор 0.125 W, SMD; Group: Резисторы; NPads: 2; Part Number: res0805; SType: SMD; Package: SMD 0805
  R1 R6 R11 R57 R60 R61 R68 R82 R84: ValueSCH: 4.7k
  R2 R3 R21 R26 R29 R33 R35-R37 R41 R44 R45 R47 R58 R59 R66 R67 R69 R70 R74 R75 R78 R79 R88 R89: ValueSCH: 1k
  R4: ValueSCH: 4k
  R5 R17 R18 R20 R31 R43 R64 R65 R108 R115: ValueSCH: 100
  R7 R19 R25 R97 R103 R104 R111 R112: ValueSCH: 2.4k
  R8 R9 R28 R34 R50 R94 R96: ValueSCH: 470
  R10 R38: ValueSCH: 150k
  R12 R102 R110: ValueSCH: 200k
  R13: ValueSCH: 600
  R14 R91: ValueSCH: 300
  R15: ValueSCH: 51k
  R16 R42: ValueSCH: 100k
  R22 R24 R46 R49: ValueSCH: 10k
  R23 R80 R95 R105 R113: ValueSCH: 39k
  R27 R109 R116: ValueSCH: 510
  R30 R53: ValueSCH: 7.5k
  R32 R39 R54 R92: ValueSCH: 0
  R40: ValueSCH: 1M
  R48 R52 R86: ValueSCH: 10k; HelpURL: C:\intmash\DBLIB2\DATASHEETS\Resistors\passive09-resistors-smd.pdf
  R51: ValueSCH: 2.2k
  R55: ValueSCH: 1k; HelpURL: C:\intmash\DBLIB2\DATASHEETS\Resistors\passive09-resistors-smd.pdf
  R56 R62 R63 R71 R72 R81 R83: ValueSCH: 330
  R73: ValueSCH: 220
  R76 R93: ValueSCH: 100M
  R77: ValueSCH: 1.5k
  R85: ValueSCH: 20k
  R87 R90 R98: ValueSCH: 3.3k
  R99: ValueSCH: 2k
  R106 R107 R114: ValueSCH: 4.3k
U1 = AM1D-0505SH30N: Преобразователь 1Вт 5В ->5В; Group: Микросхемы; SType: TH; NPads: 4; Part Number: AM1D-0505SH30N; ValueSCH: AM1D-0505SH30N; Package: SIP7
VD1-VD3 = TZMC13: Стабилитрон 13V; Part Number: TZMC13; Group: Диоды; SType: SMD; Analog: ZMM13, BZV55C13; NPads: 2; ValueSCH: TZMC4V7; Package: SOD80; HelpURL: \DATA\tzmc13.pdf
VD4 = SM712-02HTG: TVS диодная сборка 2 в 1; Group: Диоды; SType: SMD; Analog: F6450CT-ND; NPads: 3; Part Number: SM712-02HTG; ValueSCH: SM712-02HTG; Package: SOT23-3
VD5-VD7 = BAV99: Диодная сборка 2 в 1; Group: Диоды; SType: SMD; NPads: 3; Part Number: BAV99; ValueSCH: BAV99; Package: SOT23-3
VT1-VT8 = IRLML2803TR: N-канальный MOSFET 30В 1.2А; Part Number: IRLML2803TR; ValueSCH: IRLML2803TR
X1 XP12 XP14 = 15EDGVC-3.5-03P: Вилка на плату 3 конт. шаг 3.5мм; Group: Разъемы; SType: TH; NPads: 3; VariantName1: *; VariantName2: *; VariantName3: *; ValueSCH: 15EDGVC-3.5-03P; Part Number: 15EDGVC-3.5-03P
X2 XS1 = IDC-10: Вилка на плату 5х2 контактов шаг 2.54мм; Group: Разъемы; SType: TH; NPads: 10; ValueSCH: IDC-10; Part Number: IDC-10
X3 = PBD-16: Розетка на плату 8х2 контактов.2,54 х 2,54 мм; Group: Разъемы; SType: TH; NPads: 16; Part Number: PBD-16; ValueSCH: PBD-16
XP1 XP2 XP10 XP13 = 15EDGVC-3.5-02P: Вилка на плату 2 конт. шаг 3.5мм; Group: Разъемы; SType: TH; NPads: 2; VariantName1: *; VariantName2: *; ValueSCH: 15EDGVC-3.5-02P; Part Number: 15EDGVC-3.5-02P
XP3 = PLS-4: Однорядный штыревой разъем 4 шаг 2.54мм; ValueSCH: PLS-4
XP4 XP6 XP7 = PLS-2: Однорядный штыревой разъем 2 шаг 2.54мм; ValueSCH: PLS-2
XP5 = 15EDGVC-3.5-04P: Вилка на плату 4 конт. шаг 3.5мм; Group: Разъемы; SType: TH; NPads: 4; AddToBOM: 15EDGK-3.5-04P; VariantName1: *; VariantName2: *; VariantName3: *; VariantName4: *; ValueSCH: 15EDGVC-3.5-04P; Part Number: 15EDGVC-3.5-04P
XP8 XP9 = 15EDGVC-3.5-02P: Вилка на плату 2 конт. шаг 3.5мм; Group: Разъемы; SType: TH; NPads: 2; AddToBOM: 15EDGK-3.5-02P; VariantName1: *; VariantName2: *; ValueSCH: 15EDGVC-3.5-02P; Part Number: 15EDGVC-3.5-02P
Y1 = HC-49/U-S: Кварцевый осциллятор 3.2 - 60 MHz; Group: Резонаторы; SType: TH; NPads: 2; Part Number: HC-49/U-S; ValueSCH: 8MHz; HelpURL: \DATA\HC-49.pdf